# Altium schematic sheet 3V3_DIST_ZYNQ.SchDoc: My title
size A3; Organization: University of California; Address1: 475 Portola Plaza; Address2: Los Angeles, CA 90095; Revision: R01; SheetNumber: 1; SheetTotal: 1
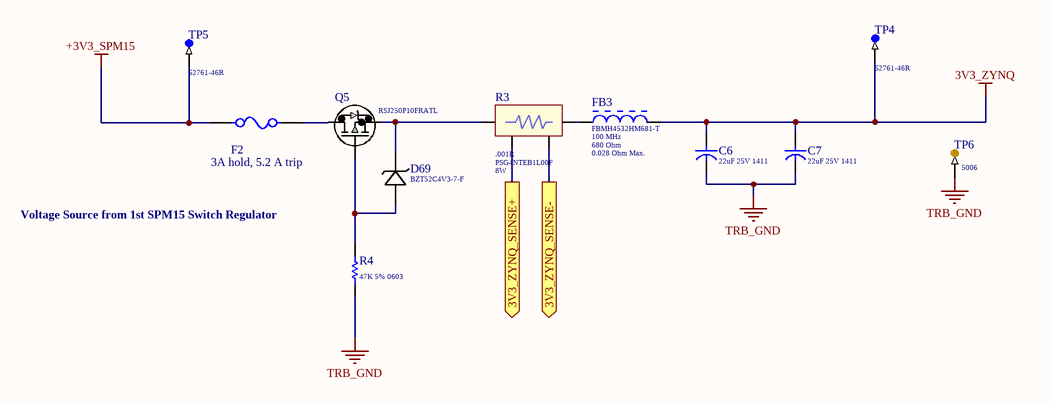
[diagram p0: 3V3_DIST_ZYNQ.SchDoc]

## Parts
C6  Capacitance: 22uF 25V 1411  [Cap_Kemet_T521B226M025ATE100_22uF]  (hidden comment: Cap_Kemet_T521B226M025ATE100_22uF)
C7  Capacitance: 22uF 25V 1411  [Cap_Kemet_T521B226M025ATE100_22uF]  (hidden comment: Cap_Kemet_T521B226M025ATE100_22uF)
D69  BZT52C4V3-7-F  [SOD123]
F2  3A hold, 5.2 A trip  [Bel_0ZCF_MFG]
FB3  Measuring Frequency: 100 MHz  Nominal Impedance: 680 Ohm  DC Resistance: 0.028 Ohm Max.  [TAYO-FBMH4532-2_V]  (hidden comment: FBMH4532HM681-T)
Q5  Series: RSJ250P10FRATL  [Mos_ROHM_RSJ250P10FRATL_25A]  (hidden comment: Mos_ROHM_RSJ250P10FRATL_25A)
R3  Resistance: .001R  Series: PSG4NTEB1L00F  Parameter 1: 8W  [SRes_KOA_PSG4NTEB1L00F_1mOhm]  (hidden comment: SRes_KOA_PSG4NTEB1L00F_1mOhm)
R4  47K 5% 0603  [RESC0603(1608)_L]
TP4  Series: S2761-46R  [TP_Harwin_S2761_46R]  (hidden comment: TP_Harwin_S2761_46R)
TP5  Series: S2761-46R  [TP_Harwin_S2761_46R]  (hidden comment: TP_Harwin_S2761_46R)
TP6  Series: 5006  [TP_Keystone_Electronics_5006]  (hidden comment: TP_Keystone_Electronics_5006)

## Ports
3V3_ZYNQ_SENSE+ (out), 3V3_ZYNQ_SENSE- (out)

## Nets
3V3_ZYNQ: C6.1 C7.1 FB3.2 TP4.1
+3V3_SPM15: F2.1 TP5.1
TRB_GND: C6.2 C7.2 R4.1 TP6.1
3V3_ZYNQ_SENSE+: R3.4 ; port 3V3_ZYNQ_SENSE+
3V3_ZYNQ_SENSE-: R3.3 ; port 3V3_ZYNQ_SENSE-
NetD69_1: D69.1 Q5.3(S) R3.1
NetD69_2: D69.2 Q5.1(G) R4.2
NetF2_2: F2.2 Q5.2(D)
NetFB3_1: FB3.1 R3.2

## Notes on the sheet
- Voltage Source from 1st SPM15 Switch Regulator
- 475 Portola Plaza
- GAPS TOF
- igarcia91@g.ucla.edu
- Los Angeles, CA
- 310-825-0344
- Size:
- Date:
- Letter
- Number:
- Time:
- Sheet
- Revision:
- of
- andrew.peck@cern.ch
- spq@ucla.edu
- File:

## Library data of the parts
C6 C7 = Cap_Kemet_T521B226M025ATE100_22uF: Tantalum Capacitors - Polymer SMD 25V 22uF 1311 20% ESR=100mOhms; Supplier 1: Mouser; Supplier Part Number 1: 80-T521B226M25ATE100
D69 = BZT52C4V3-7-F: Zener Diodes 500mW 4.3V Zener AEC-Q101 Qualified; Vendor: Diodes Inc; Built_By: EMA_UL_Team; Type: DEV; C: Copyright (C) 2015 Accelerated Designs. All rights reserved; Manufacturer_Part_Number: BZT52C4V3-7-F; RefDes: RefDes; Supplier 1: Mouser; Supplier Part Number 1: 621-BZT52C4V3-F; Series: BZT52C4V3-7-F
F2 = 0ZCF0300BF2C: Resettable Fuses - PPTC 3A 24V PPTC 2920 SMD; Supplier 1: Mouser; Supplier 2: Digi-Key; Supplier Part Number 1: 530-0ZCF0300BF2C; Supplier Part Number 2: 507-2072-6-ND
FB3 = FBMH4532HM681-T: Chip Bead Inductor for Power Lines, 680 Ohm, 4 A, -40 to 125 degC, 2-Pin 4.5 x 3.2 x 3.5 mm SMD, RoHS, Taping; Manufacturer: Taiyo Yuden; Rated Current: 4 A Max.; Impedance Tolerance: +/- 25%; ComponentLink1Description: Manufacturer URL; ComponentLink2Description: Datasheet; DatasheetVersion: 09/2014; ComponentLink3URL: http://www.yuden.co.jp/productdata/catalog/en/chipbeads01_e.pdf; ComponentLink3Description: Package Specification; ComponentLink1URL: http://www.t-yuden.com/; Mounting Technology: Surface Mount; Packing: Taping; Temperature Range: -40 to 125 degC; PartNumber: FBMH4532HM681-T; PackageDescription: 2-Pin Surface Mount Device, Body 4.5 x 3.2 mm, Height 3.5 mm; ComponentLink2URL: http://www.yuden.co.jp/productdata/catalog/en/chipbeads01_e.pdf; RoHS: TRUE; Supplier 1: Digi-Key; Supplier Part Number 1: 587-1761-6-ND
Q5 = Mos_ROHM_RSJ250P10FRATL_25A: MOSFET Pch -100V Vds -25A 0.05Rds(on) 60Qg; Supplier 1: Mouser; Supplier Part Number 1: 755-RSJ250P10FRATL
R3 = SRes_KOA_PSG4NTEB1L00F_1mOhm: Current Sense Resistors - SMD 1mOhm 8W 1% 50ppm AEC-Q200 Power Shunt; Supplier 1: Mouser; Supplier Part Number 1: 660-PSG4NTEB1L00F
R4 = CMP-1012-00114-1: 47K 0.1W 5% 0603 (1608 Metric)  SMD; Case-EIA: 0603; Value: 47000.00 Ohm; Case-Metric: 1608; Tolerance: 5 %; Power: 0.1 W; Technology: SMT
TP4 TP5 = TP_Harwin_S2761_46R: Circuit Board Hardware - PCB SMT Mini Test Terminal, Reel; Supplier 1: Newark; Supplier Part Number 1: 76Y5391
TP6 = TP_Keystone_Electronics_5006: Circuit Board Hardware - PCB TEST POINT BLK .063; Supplier 1: Mouser; Supplier Part Number 1: 534-5006